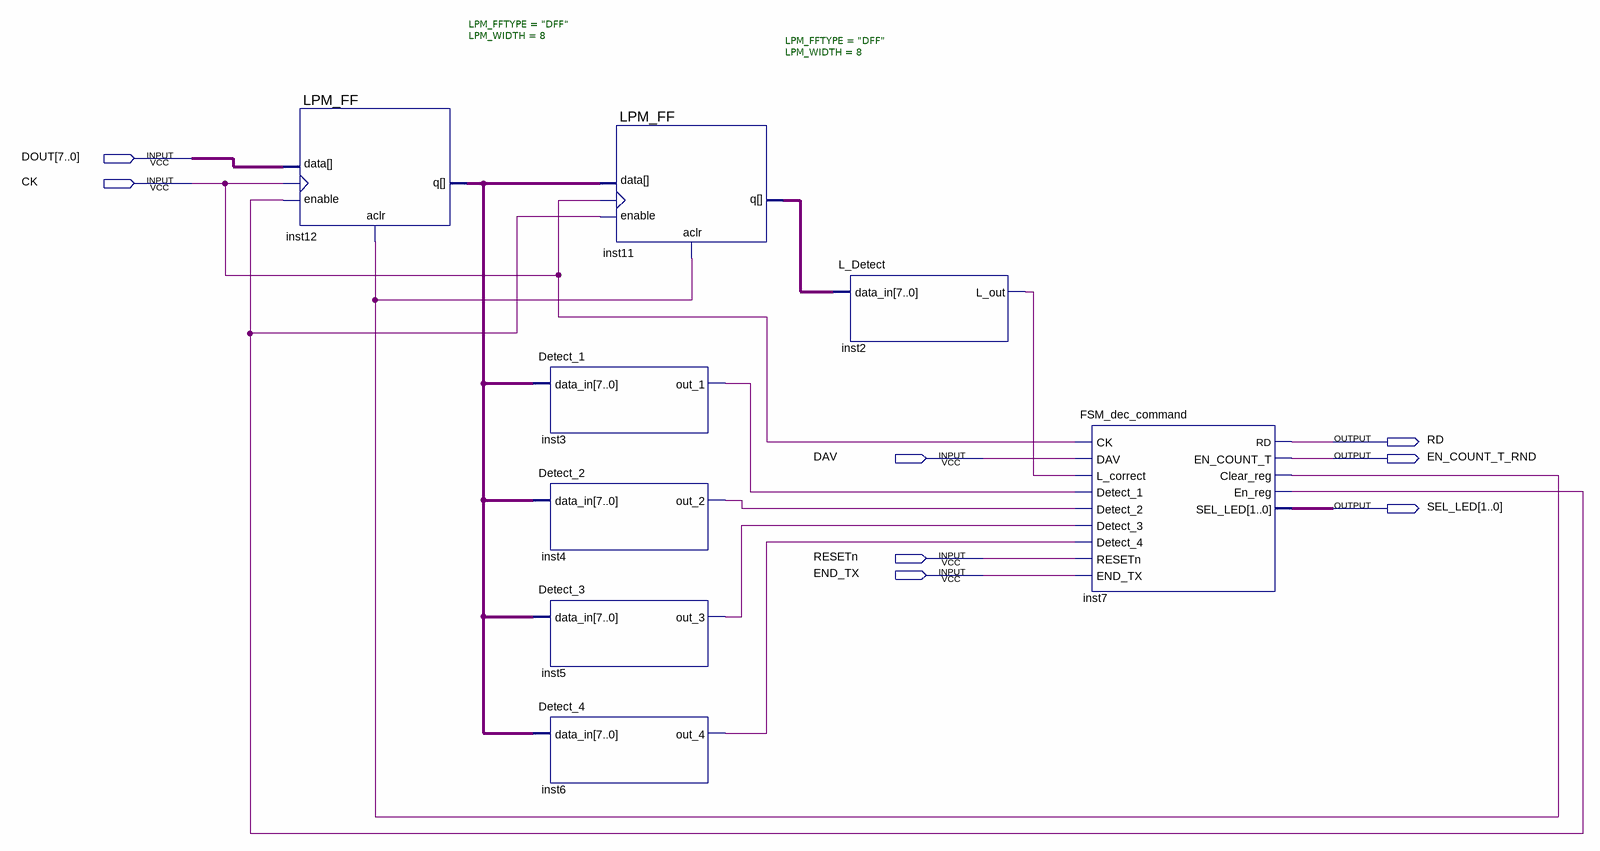
[diagram p0: schematic sheet]
// Quartus schematic dec_command.bdf as structural Verilog: 8 symbols, 8 pins
module dec_command (
  input  [7:0] DOUT,
  input  CK,
  input  DAV,
  input  RESETn,
  input  END_TX,
  output RD,
  output EN_COUNT_T_RND,
  output [1:0] SEL_LED
);

  wire inst2_l_out, inst3_out_1, inst4_out_2, inst5_out_3, inst6_out_4, inst7_clear_reg, inst7_en_reg;
  wire [7:0] inst11_q, inst12_q;

  LPM_FF #(.LPM_FFTYPE("DFF"), .LPM_WIDTH(8)) inst12 (
    .aclr(inst7_clear_reg), .clock(CK), .data(DOUT), .enable(inst7_en_reg), .q(inst12_q));
  Detect_1 inst3 (.data_in(inst12_q), .out_1(inst3_out_1));
  Detect_2 inst4 (.data_in(inst12_q), .out_2(inst4_out_2));
  Detect_3 inst5 (.data_in(inst12_q), .out_3(inst5_out_3));
  Detect_4 inst6 (.data_in(inst12_q), .out_4(inst6_out_4));
  LPM_FF #(.LPM_FFTYPE("DFF"), .LPM_WIDTH(8)) inst11 (
    .aclr(inst7_clear_reg), .clock(CK), .data(inst12_q), .enable(inst7_en_reg), .q(inst11_q));
  L_Detect inst2 (.data_in(inst11_q), .L_out(inst2_l_out));
  FSM_dec_command inst7 (
    .CK(CK), .DAV(DAV), .L_correct(inst2_l_out), .Detect_1(inst3_out_1), .Detect_2(inst4_out_2),
    .Detect_3(inst5_out_3), .Detect_4(inst6_out_4), .RESETn(RESETn), .END_TX(END_TX), .RD(RD),
    .EN_COUNT_T(EN_COUNT_T_RND), .Clear_reg(inst7_clear_reg), .En_reg(inst7_en_reg), .SEL_LED(SEL_LED));
endmodule
